# Altium schematic sheet FOOT_CN.SchDoc
size A4; SheetNumber: 3; SheetTotal: 13
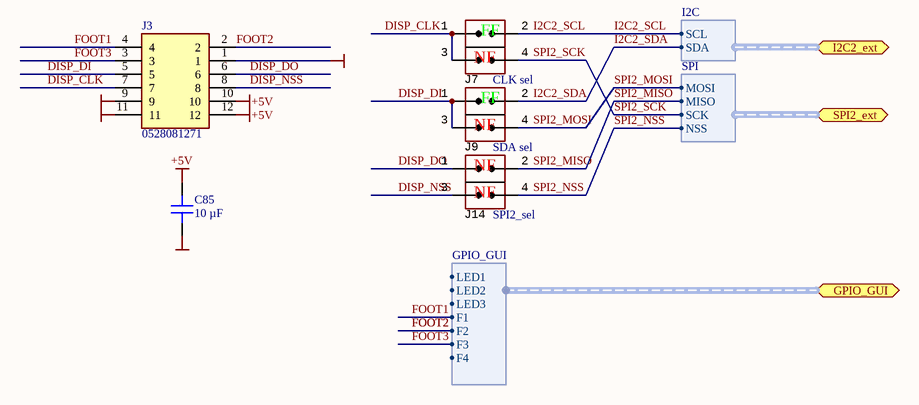
[diagram p0: FOOT_CN.SchDoc]

## Parts
C85  10 µF  [CAP 0805_2012]
J3  0528081271  [AFA11-S12GLA-00]
J7  (no value)  [CON: JUMPER x2]
J9  (no value)  [CON: JUMPER x2]
J14  (no value)  [CON: JUMPER x2]

## Ports
GPIO_GUI (bidir, harness GPIO_GUI), I2C2_ext (bidir, harness I2C), SPI2_ext (bidir, harness SPI)

## Harnesses
I2C: SCL, SDA
SPI: MOSI, MISO, SCK, NSS
GPIO_GUI: LED1, LED2, F1, F2, F3, F4, LED3

## Nets
+5V: C85.2 J3.10 J3.12
GND: C85.1 J3.1 J3.9 J3.11
DISP_CLK: J3.7 J7.1(IN) J7.3(IN)
DISP_DI: J3.5 J9.1(IN) J9.3(IN)
DISP_DO: J3.6 J14.1(IN)
DISP_NSS: J3.8 J14.3(IN)
FOOT1: J3.4 ; port GPIO_GUI.F1
FOOT2: J3.2 ; port GPIO_GUI.F2
FOOT3: J3.3 ; port GPIO_GUI.F3
I2C2_SCL: J7.2(IN) ; port I2C2_ext.SCL
I2C2_SDA: J9.2(IN) ; port I2C2_ext.SDA
SPI2_MISO: J14.2(IN) ; port SPI2_ext.MISO
SPI2_MOSI: J9.4(IN) ; port SPI2_ext.MOSI
SPI2_NSS: J14.4(IN) ; port SPI2_ext.NSS
SPI2_SCK: J7.4(IN) ; port SPI2_ext.SCK

## Notes on the sheet
- (near J7) NF
- (near J7) FF
- (near J9) FF
- CLK sel
- (near J9) NF
- (near J14) NF
- SDA sel
- (near J14) SPI2_sel

## Library data of the parts
C85 = C0805C106K8PAC7800: CAP CER 10UF 10V X5R 0805; manufacturer: KEMET; Tolerance: ±10%; Part Number: C0805C106K8PAC7800; Value: 10 µF; Applications: Bypass, Decoupling; Capacitance: 10 µF; componentlink1description: Datasheet; componentlink1url: https://connect.kemet.com:7667/gateway/IntelliData-ComponentDocumentation/1.0/download/datasheet/C0805C106K8PACTU; componentlink2description: DigiKey Link; componentlink2url: https://www.digikey.com/en/products/detail/kemet/C0805C106K8PAC7800/1090830; Device Package: 0805 (2012 Metric); lastupdated: 9/14/2022 7:51:56 AM; Lifecycle Status: Active; Minimum Order: 1; Mounting Type: Surface Mount, MLCC; Operating Temperature: -55°C ~ 85°C; Package / Case: 0805 (2012 Metric); packaging: TapeAndReel; partid: 44790; Part Status: Active; price: 0.02; series: SMD Comm X5R; Size / Dimension: 0.079" L x 0.049" W (2.00mm x 1.25mm); Supplier 1: DigiKey; Supplier Part Number 1: 399-C0805C106K8PAC7800CT-ND; Temperature Coefficient: X5R; Thickness (Max): 0.055" (1.40mm); Voltage - Rated: 10V
J3 = 0528081271: Connector; Manufacturer_Name: Molex; Datasheet Link: https://www.molex.com/pdm_docs/sd/528082071_sd.pdf; Height: 5.3mm; Manufacturer_Part_Number: 0528081271; System: Connector
J7 J9 J14 = Jumper_double: CommentText: "Перемычка"